# Altium schematic sheet S3220B1.SchDoc: Power supply and interfaces
size A3; Revision: B; SheetNumber: 1; SheetTotal: 5
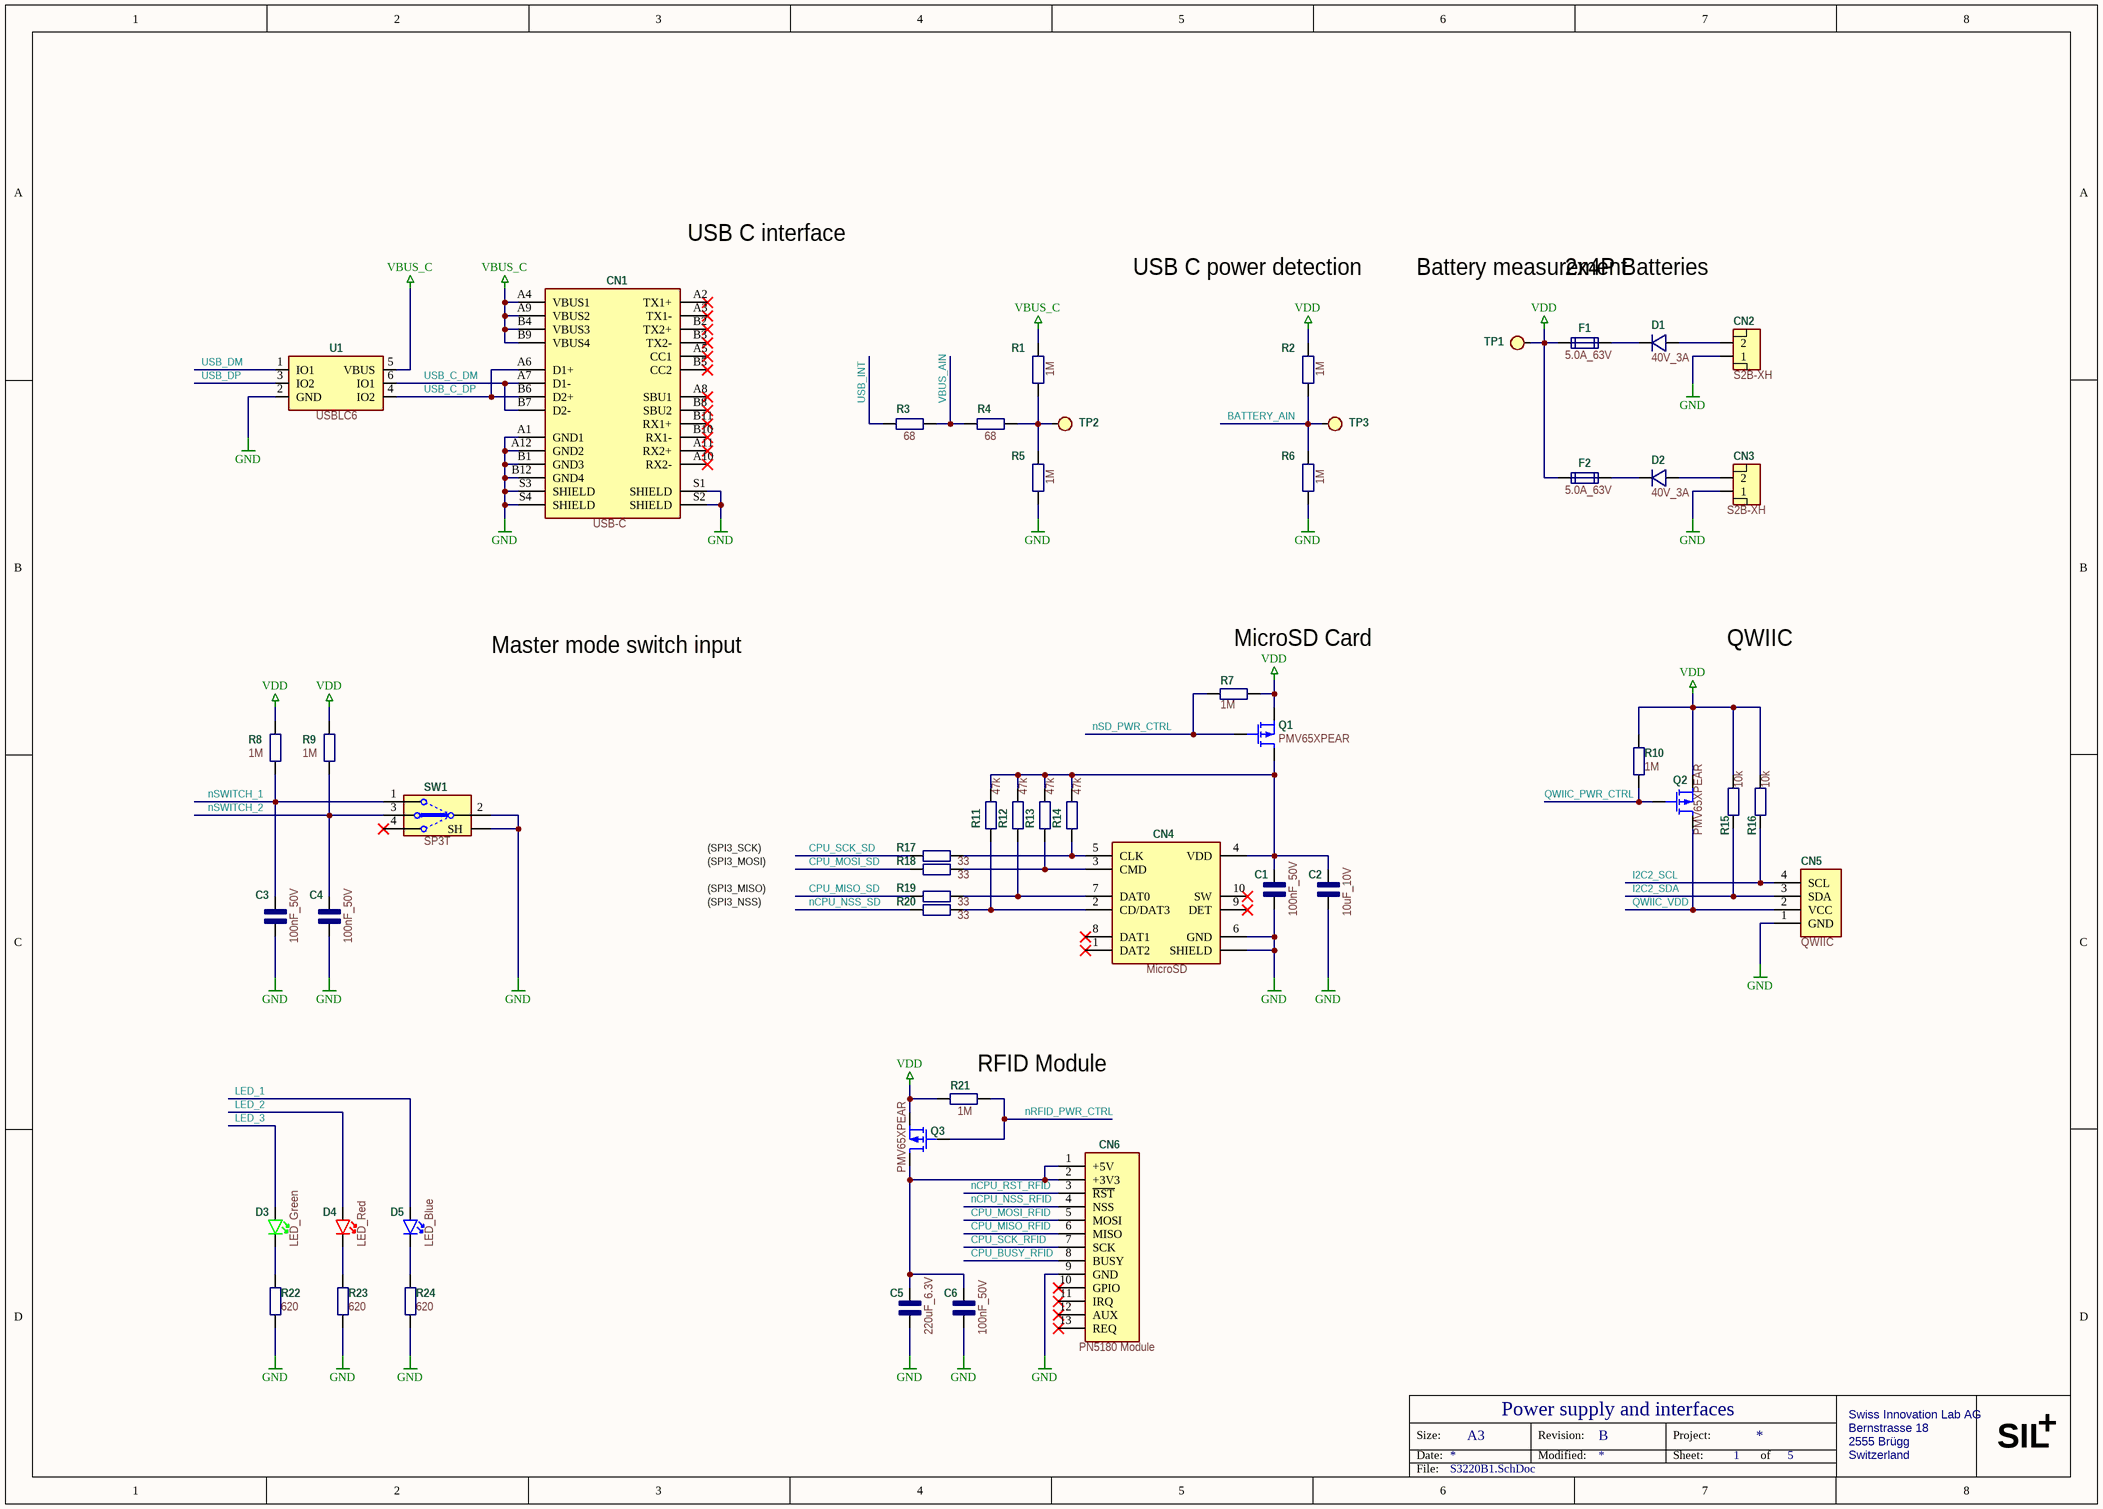
[diagram p0: S3220B1.SchDoc]

## Parts
C1  100nF_50V  [C_0603]
C2  10uF_10V  [C_0603]
C3  100nF_50V  [C_0603]
C4  100nF_50V  [C_0603]
C5  220uF_6.3V  [C_1206]
C6  100nF_50V  [C_0603]
CN1  USB-C  [CN_USB-C-RA_2]
CN2  S2B-XH  [CN_S2B-XH-A]
CN3  S2B-XH  [CN_S2B-XH-A]
CN4  MicroSD  [CN_MicroSD-Holder]
CN5  QWIIC  [CN_SM04B-SRSS-TB]
CN6  PN5180 Module  [CN_RFID-PN5180]  (no BOM)
D1  40V_3A  [D_DO-214AC]
D2  40V_3A  [D_DO-214AC]
D3  LED_Green  [LED_2-SMD_4x4]
D4  LED_Red  [LED_2-SMD_4x4]
D5  LED_Blue  [LED_2-SMD_4x4]
F1  5.0A_63V  [F_1206]
F2  5.0A_63V  [F_1206]
Q1  PMV65XPEAR  [U_SOT23-3]
Q2  PMV65XPEAR  [U_SOT23-3]
Q3  PMV65XPEAR  [U_SOT23-3]
R1  1M  [R_0603]
R2  1M  [R_0603]
R3  68  [R_0603]
R4  68  [R_0603]
R5  1M  [R_0603]
R6  1M  [R_0603]
R7  1M  [R_0603]
R8  1M  [R_0603]
R9  1M  [R_0603]
R10  1M  [R_0603]
R11  47k  [R_0603]
R12  47k  [R_0603]
R13  47k  [R_0603]
R14  47k  [R_0603]
R15  10k  [R_0603]
R16  10k  [R_0603]
R17  33  [R_0603]
R18  33  [R_0603]
R19  33  [R_0603]
R20  33  [R_0603]
R21  1M  [R_0603]
R22  620  [R_0603]
R23  620  [R_0603]
R24  620  [R_0603]
SW1  SP3T  [SW_SLIDE-SP3T]
TP1  Test point  [TP_SMD_R1.0mm]  (value not drawn)  (no BOM)
TP2  Test point  [TP_SMD_R1.0mm]  (value not drawn)  (no BOM)
TP3  Test point  [TP_SMD_R1.0mm]  (value not drawn)  (no BOM)
U1  USBLC6  [U_SOT23-6]

## Nets
GND: C1.1 C2.1 C3.1 C4.1 C5.1 C6.1 CN1.A1(GND1) CN1.A12(GND2) CN1.B1(GND3) CN1.B12(GND4) CN1.S1(SHIELD) CN1.S2(SHIELD) CN1.S3(SHIELD) CN1.S4(SHIELD) CN2.1 CN3.1 CN4.0(SHIELD) CN4.6(GND) CN5.1(GND) CN6.9(GND) R5.1 R6.1 R22.2 R23.2 R24.2 SW1.0(SH) SW1.2 U1.2(GND)
VBUS_C: CN1.A4(VBUS1) CN1.A9(VBUS2) CN1.B4(VBUS3) CN1.B9(VBUS4) R1.2 U1.5(VBUS)
VDD: F1.1 F2.1 Q1.2(S) Q2.2(S) Q3.2(S) R2.2 R7.1 R8.2 R9.2 R10.2 R15.2 R16.2 R21.1 TP1.1
BATTERY_AIN: R2.1 R6.2 TP3.1
CPU_BUSY_RFID: CN6.8(BUSY)
CPU_MISO_RFID: CN6.6(MISO)
CPU_MISO_SD: R19.1
CPU_MOSI_RFID: CN6.5(MOSI)
CPU_MOSI_SD: R18.1
CPU_SCK_RFID: CN6.7(SCK)
CPU_SCK_SD: R17.1
I2C2_SCL: CN5.4(SCL) R16.1
I2C2_SDA: CN5.3(SDA) R15.1
LED_1: D5.1(A)
LED_2: D4.1(A)
LED_3: D3.1(A)
nCPU_NSS_RFID: CN6.4(NSS)
nCPU_NSS_SD: R20.1
nCPU_RST_RFID: CN6.3(~{RST})
nRFID_PWR_CTRL: Q3.1(G) R21.2
nSD_PWR_CTRL: Q1.1(G) R7.2
nSWITCH_1: C3.2 R8.1 SW1.1
nSWITCH_2: C4.2 R9.1 SW1.3
QWIIC_PWR_CTRL: Q2.1(G) R10.1
QWIIC_VDD: CN5.2(VCC) Q2.3(D)
USB_C_DM: CN1.A7(D1-) CN1.B7(D2-) U1.6(IO1)
USB_C_DP: CN1.A6(D1+) CN1.B6(D2+) U1.4(IO2)
USB_DM: U1.1(IO1)
USB_DP: U1.3(IO2)
USB_INT: R3.1
VBUS_AIN: R3.2 R4.1
NetC1_2: C1.2 C2.2 CN4.4(VDD) Q1.3(D) R11.2 R12.2 R13.2 R14.2
NetC5_2: C5.2 C6.2 CN6.1(+5V) CN6.2(+3V3) Q3.3(D)
NetCN2_2: CN2.2 D1.A
NetCN3_2: CN3.2 D2.A
NetCN4_2: CN4.2(CD/DAT3) R11.1 R20.2
NetCN4_3: CN4.3(CMD) R13.1 R18.2
NetCN4_5: CN4.5(CLK) R14.1 R17.2
NetCN4_7: CN4.7(DAT0) R12.1 R19.2
NetD1_K: D1.K F1.2
NetD2_K: D2.K F2.2
NetD3_2: D3.2(K) R22.1
NetD4_2: D4.2(K) R23.1
NetD5_2: D5.2(K) R24.1
NetR1_1: R1.1 R4.2 R5.2 TP2.1

Not connected (* = marked no-connect by the designer): CN1 A2(TX1+)* A3(TX1-)* A5(CC1)* A8(SBU1)* A10(RX2-)* A11(RX2+)* B2(TX2+)* B3(TX2-)* B5(CC2)* B8(SBU2)* B10(RX1-)* B11(RX1+)*; CN4 1(DAT2)* 8(DAT1)* 9(DET)* 10(SW)* X1 X2; CN6 10(GPIO)* 11(IRQ)* 12(AUX)* 13(REQ)*; SW1 4*

## Notes on the sheet
- USB C interface
- USB C power detection
- Battery measurement
- 2x4P Batteries
- (near R7) MicroSD Card
- QWIIC
- Master mode switch input
- (SPI3_SCK)
- (SPI3_NSS)
- (SPI3_MISO)
- (SPI3_MOSI)
- (near R21) RFID Module
- Size:
- Date:
- A3
- Revision:
- Modified:
- Project:
- Sheet:
- of
- Swiss Innovation Lab AG
- Bernstrasse 18
- 2555 Brügg
- Switzerland
- SIL
- +
- File:

## Library data of the parts
C1 C3 C4 C6 = C_100nF_50V: 0.1µF ±10% 50V Ceramic Capacitor X7R 0603 (1608 Metric); Manufacturer: TDK; Manufacturer Part Number: C1608X7R1H104K080AA; Value: 100nF; ValueAux: _50V; Currency: $; Price: 0,01309; Supplier 1: Digi-Key; Supplier Part Number 1: 445-1314-6-ND
C2 = C_10uF_10V: 10µF ±10% 10V Ceramic Capacitor X5R 0603 (1608 Metric); Manufacturer: Murata Electronics North America; Manufacturer Part Number: GRM188R61A106KE69D; Value: 10uF; ValueAux: _10V; Currency: $; Price: 0,03994; Supplier 1: Digi-Key; Supplier Part Number 1: 490-10474-1-ND
C5 = C_220uF_6.3V: 220µF ±20% 6.3V Ceramic Capacitor X5R 1206 (3216 Metric); Manufacturer: Murata Electronics North America; Manufacturer Part Number: GRM31CR60J227ME11L; Value: 220uF; ValueAux: _6.3V; Currency: $; Price: 0,59945; Supplier 1: Digi-Key; Supplier Part Number 1: 490-13970-1-ND
CN1 = CN_USB-C-RA_2: USB-C (USB TYPE-C) USB 3.2 Gen 2 (USB 3.1 Gen 2, Superspeed + (USB 3.1)) Receptacle Connector 24 Position Surface Mount, Right Angle; Through Hole; Manufacturer: CUI Devices; Manufacturer Part Number: UJ31-CH-G-SMT-TR-67; Currency: $; Value: USB-C; Price: 2,43252; Supplier 1: Digi-Key; Supplier Part Number 1: 2223-UJ31-CH-G-SMT-TR-67CT-ND
CN2 CN3 = CN_S2B-XH: Connector Header Through Hole, Right Angle 2 position 0.098" (2.50mm); Manufacturer: JST Sales America Inc.; Manufacturer Part Number: S2B-XH-A(LF)(SN); Currency: $; Supplier 1: Digi-Key; Supplier Part Number 1: 455-2257-ND; Value: S2B-XH; Price: 0,07792
CN4 = CN_MicroSD-Holder: 10 (8 + 2) Position Card Connector Secure Digital microSD Surface Mount, Right Angle Gold; Manufacturer: Molex; Manufacturer Part Number: 5031821852; Currency: $; Value: MicroSD; Price: 2,94830; Supplier 1: Digi-Key; Supplier Part Number 1: WM12834CT-ND
CN5 = CN_QWICC: Connector Header Surface Mount, Right Angle 4 position 0.039" (1.00mm); Manufacturer: JST Sales America Inc.; Manufacturer Part Number: SM04B-SRSS-TB(LF)(SN); Currency: $; Supplier 1: Digi-Key; Supplier Part Number 1: 455-1804-1-ND; Value: QWIIC; Price: 0,61
CN6 = CN_RFID-PN5180: RFID Module PN5180; Manufacturer: Swiss Innovation Lab; Currency: $; Manufacturer Part Number: RFID-PN5180; Supplier 1: Swiss Innovation Lab; Supplier Part Number 1: RFID-PN5180; Value: PN5180 Module; Price: 5
D1 D2 = D_40V_3A: Diode Schottky 40V 3A Surface Mount DO-214AC (SMA); Manufacturer: Comchip Technology; Manufacturer Part Number: CDBA340L-HF; ValueAux: _3A; Currency: $; Value: 40V; Price: 0,25740; Supplier 1: Digi-Key; Supplier Part Number 1: 641-1702-6-ND
D3 = D_LED_G_2mA: Green 570nm LED Indication - Discrete 1.8V 2-SMD, Boomerang; Manufacturer: OSRAM Opto Semiconductors Inc.; Manufacturer Part Number: LG A67K-G2K1-24-0-2-R33-Z; ValueAux: _Green; Currency: $; Value: LED; Price: 0,10408; Supplier 1: Digi-Key; Supplier Part Number 1: 475-LGA67K-G2K1-24-0-2-R33-ZTR-ND
D4 = D_LED_R_2mA: Red 630nm LED Indication - Discrete 1.8V 2-SMD, Boomerang; Manufacturer: OSRAM Opto Semiconductors Inc.; Manufacturer Part Number: LS A67K-J1K2-1-Z; ValueAux: _Red; Currency: $; Value: LED; Price: 0,10626; Supplier 1: Digi-Key; Supplier Part Number 1: 475-3123-1-ND
D5 = D_LED_B_10mA: Blue 471nm LED Indication - Discrete 3.1V 2-SMD, Boomerang; Manufacturer: OSRAM Opto Semiconductors Inc.; Manufacturer Part Number: LB A673-L2N1-35-Z; ValueAux: _Blue; Currency: $; Value: LED; Price: 0,11695; Supplier 1: Digi-Key; Supplier Part Number 1: LBA673-L2N1-35-Z-ND
F1 F2 = F_5A_63V: FUSE BOARD MNT 5A 63VAC/VDC 1206; Manufacturer: Bel Fuse Inc.; Manufacturer Part Number: C1S 5; Value: 5.0A; ValueAux: _63V; Currency: $; Price: 0,17995; Supplier 1: Digi-Key; Supplier Part Number 1: 507-1194-1-ND
Q1-Q3 = Q_PMV65: P-Channel 20V 2.8A (Ta) 480mW (Ta), 6.25W (Tc) Surface Mount TO-236AB (SOT23); Manufacturer: Nexperia USA Inc.; Currency: $; Value: PMV65XPEAR; Manufacturer Part Number: PMV65XPEAR; Price: 0,11204; Supplier 1: Digi-Key; Supplier Part Number 1: 1727-2310-1-ND
R1 R2 R5-R10 R21 = R_1M_1%: 1 MOhms ±1% 0.1W, 1/10W Chip Resistor 0603 (1608 Metric) Automotive AEC-Q200 Thick Film; Manufacturer: Panasonic Electronic Components; Manufacturer Part Number: ERJ-3EKF1004V; Currency: $; Value: 1M; Price: 0,01264; Supplier 1: Digi-Key; Supplier Part Number 1: P1.00MHCT-ND
R3 R4 = R_68_1%: 68 Ohms ±1% 0.1W, 1/10W Chip Resistor 0603 (1608 Metric) Automotive AEC-Q200 Thick Film; Manufacturer: Panasonic Electronic Components; Manufacturer Part Number: ERJ-3EKF68R0V; Currency: $; Value: 68; Price: 0,01449; Supplier 1: Digi-Key; Supplier Part Number 1: P68.0HCT-ND
R11-R14 = R_47k_1%: 47 kOhms ±1% 0.1W, 1/10W Chip Resistor 0603 (1608 Metric) Automotive AEC-Q200 Thick Film; Manufacturer: Panasonic Electronic Components; Manufacturer Part Number: ERJ-3EKF4702V; Currency: $; Value: 47k; Price: 0,00670; Supplier 1: Digi-Key; Supplier Part Number 1: P47.0KHCT-ND
R15 R16 = R_10k_1%: 10 kOhms ±1% 0.1W, 1/10W Chip Resistor 0603 (1608 Metric) Automotive AEC-Q200 Thick Film; Manufacturer: Panasonic Electronic Components; Manufacturer Part Number: ERJ-3EKF1002V; Currency: $; Value: 10k; Price: 0,01449; Supplier 1: Digi-Key; Supplier Part Number 1: P10.0KHCT-ND
R17-R20 = R_33_1%: 33 Ohms ±1% 0.1W, 1/10W Chip Resistor 0603 (1608 Metric) Automotive AEC-Q200 Thick Film; Manufacturer: Panasonic Electronic Components; Manufacturer Part Number: ERJ-3EKF33R0V; Currency: $; Value: 33; Price: 0,01449; Supplier 1: Digi-Key; Supplier Part Number 1: P33.0HCT-ND
R22-R24 = R_620_1%: 620 Ohms ±1% 0.1W, 1/10W Chip Resistor 0603 (1608 Metric) Automotive AEC-Q200 Thick Film; Manufacturer: Panasonic Electronic Components; Manufacturer Part Number: ERJ-3EKF6200V; Currency: $; Value: 620; Price: 0,01273; Supplier 1: Digi-Key; Supplier Part Number 1: P620HCT-ND
SW1 = SW_SP3T_Slide: Slide Switch SP3T Through Hole, Right Angle; Manufacturer: C&K; Manufacturer Part Number: OS103011MA7QP1; Currency: $; Value: SP3T; Price: 0,42483; Supplier 1: Digi-Key; Supplier Part Number 1: CKN9561-ND
TP1-TP3 = TP_Test_point: Manufacturer: Swiss Innovation Lab; Currency: $; Value: Test point; Manufacturer Part Number: Test point; Price: 0
U1 = U_USBLC6: TVS DIODE 5.25V 17V SOT23-6; Manufacturer: STMicroelectronics; Manufacturer Part Number: USBLC6-2SC6Y; Currency: $; Value: USBLC6; Price: 0,33501; Supplier 1: Digi-Key; Supplier Part Number 1: 497-11882-6-ND